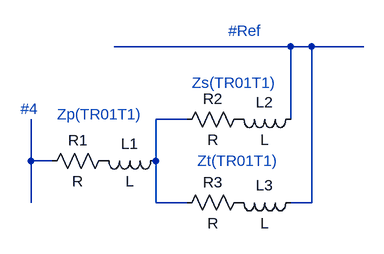
[diagram p0: schematic Seq Zero TR01T1.asc]
Seq Zero TR01T1.asc, the LTspice schematic file:
Version 4
SHEET 1 880 680
WIRE 336 -96 64 -96
WIRE 368 -96 336 -96
WIRE 448 -96 368 -96
WIRE 176 16 128 16
WIRE 336 16 336 -96
WIRE -64 80 -64 16
WIRE -32 80 -64 80
WIRE 128 80 128 16
WIRE -64 144 -64 80
WIRE 128 144 128 80
WIRE 176 144 128 144
WIRE 368 144 368 -96
WIRE 368 144 336 144
SYMBOL res 64 64 R90
WINDOW 0 0 56 VBottom 2
WINDOW 3 32 56 VTop 2
SYMATTR InstName R1
SYMBOL ind 144 64 R90
WINDOW 0 5 56 VBottom 2
WINDOW 3 32 56 VTop 2
SYMATTR InstName L1
SYMBOL res 272 0 R90
WINDOW 0 0 56 VBottom 2
WINDOW 3 32 56 VTop 2
SYMATTR InstName R2
SYMBOL ind 352 0 R90
WINDOW 0 5 56 VBottom 2
WINDOW 3 32 56 VTop 2
SYMATTR InstName L2
SYMBOL res 272 128 R90
WINDOW 0 0 56 VBottom 2
WINDOW 3 32 56 VTop 2
SYMATTR InstName R3
SYMBOL ind 352 128 R90
WINDOW 0 5 56 VBottom 2
WINDOW 3 32 56 VTop 2
SYMATTR InstName L3
TEXT -24 8 Left 2 ;Zp(TR01T1)
TEXT -80 0 Left 2 ;#4
TEXT 184 -40 Left 2 ;Zs(TR01T1)
TEXT 192 80 Left 2 ;Zt(TR01T1)
TEXT 240 -120 Left 2 ;#Ref

The netlist it stands for:
* Seq Zero TR01T1.asc
R1 P001 N003 R
L1 N002 P001 L
R2 P002 N002 R
L2 N001 P002 L
R3 P003 N002 R
L3 N001 P003 L
* Zp(TR01T1)
* #4
* Zs(TR01T1)
* Zt(TR01T1)
* #Ref
.backanno
.end